# Altium schematic sheet Main schematic.SchDoc
size A4
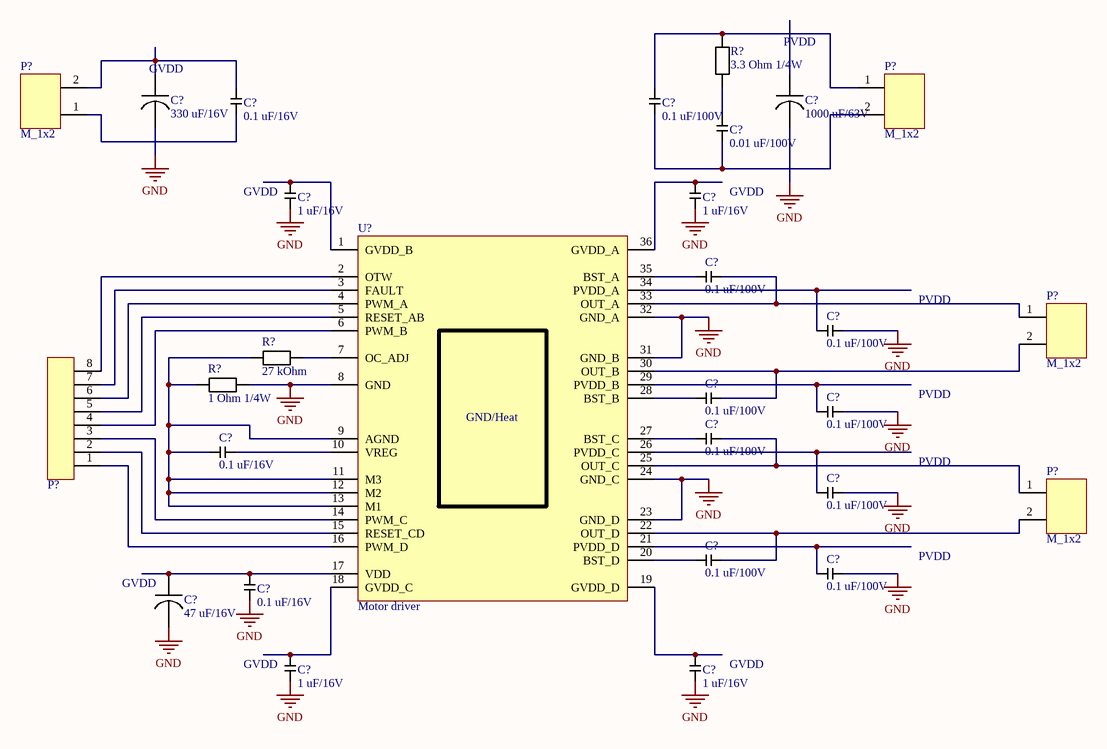
[diagram p0: Main schematic.SchDoc]

## Parts
(Parts that share a designator on the sheet are numbered #1, #2 ... from top to bottom, then left to right.)
*  GVDD
*?#1  PVDD
*?#2  GVDD
*?#3  GVDD
*?#4  PVDD
*?#5  PVDD
*?#6  PVDD
*?#7  PVDD
*?#8  GVDD
*?#9  GVDD
*?#10  GVDD
C?#1  value 330 uF/16V  [C_EL_SMT_Ø10]  (hidden comment: C_EL_SMT_Ø10)
C?#2  value 0.1 uF/16V  [C_SMD_0805_pcb]  (hidden comment: SMD)
C?#3  value 0.1 uF/100V  [C_SMD_0805_pcb]  (hidden comment: SMD)
C?#4  value 1000 uF/63V  [C_EL_SMT_Ø18]  (hidden comment: C_EL_SMT_Ø18)
C?#5  value 0.01 uF/100V  [C_SMD_0805_pcb]  (hidden comment: SMD)
C?#6  value 1 uF/16V  [C_SMD_0805_pcb]  (hidden comment: SMD)
C?#7  value 1 uF/16V  [C_SMD_0805_pcb]  (hidden comment: SMD)
C?#8  value 0.1 uF/100V  [C_SMD_0805_pcb]  (hidden comment: SMD)
C?#9  value 0.1 uF/100V  [C_SMD_0805_pcb]  (hidden comment: SMD)
C?#10  value 0.1 uF/100V  [C_SMD_0805_pcb]  (hidden comment: SMD)
C?#11  value 0.1 uF/100V  [C_SMD_0805_pcb]  (hidden comment: SMD)
C?#12  value 0.1 uF/100V  [C_SMD_0805_pcb]  (hidden comment: SMD)
C?#13  value 0.1 uF/16V  [C_SMD_0805_pcb]  (hidden comment: SMD)
C?#14  value 0.1 uF/100V  [C_SMD_0805_pcb]  (hidden comment: SMD)
C?#15  value 0.1 uF/100V  [C_SMD_0805_pcb]  (hidden comment: SMD)
C?#16  value 0.1 uF/100V  [C_SMD_0805_pcb]  (hidden comment: SMD)
C?#17  value 0.1 uF/16V  [C_SMD_0805_pcb]  (hidden comment: SMD)
C?#18  value 47 uF/16V  [C_EL_SMT_Ø6.3]  (hidden comment: C_EL_SMT_Ø6.3)
C?#19  value 1 uF/16V  [C_SMD_0805_pcb]  (hidden comment: SMD)
C?#20  value 1 uF/16V  [C_SMD_0805_pcb]  (hidden comment: SMD)
P?#1  M_1x2  [PIN_HEADER_M_1x2]
P?#2  M_1x2  [PIN_HEADER_M_1x2]
P?#3  M_1x2  [PIN_HEADER_M_1x2]
P?#4  M_1x10  [PIN_HEADER_M_1X8]  (value not drawn)
P?#5  M_1x2  [PIN_HEADER_M_1x2]
R?#1  value 3.3 Ohm 1/4W  [R_SMD_0805_pcb]  (hidden comment: SMD)
R?#2  value 27 kOhm  [R_SMD_0805_pcb]  (hidden comment: SMD)
R?#3  value 1 Ohm 1/4W  [R_SMD_0805_pcb]  (hidden comment: SMD)
U?  Motor driver  [DRV8432DKDR-SOP36]

## Nets
GND: C?#1.1 C?#4.1 C?#6.1 C?#7.1 C?#9.1 C?#11.1 C?#14.1 C?#16.1 C?#17.2 C?#18.1 C?#19.2 C?#20.2 R?#3.2 U?.8(GND) U?.23(GND_D) U?.24(GND_C) U?.31(GND_B) U?.32(GND_A)
Net*?#1_5: *?#1.5 C?#4.2
Net*?#2_5: *?#2.5 C?#1.2 C?#2.1 P?#1.2
Net*?#3_5: *?#3.5 C?#6.2 U?.1(GVDD_B)
Net*?#4_5: *?#4.5 C?#9.2 U?.34(PVDD_A)
Net*?#5_5: *?#5.5 C?#11.2 U?.29(PVDD_B)
Net*?#6_5: *?#6.5 C?#14.2 U?.26(PVDD_C)
Net*?#7_5: *?#7.5 C?#16.2 U?.21(PVDD_D)
Net*?#8_5: *?#8.5 C?#17.1 C?#18.2 U?.17(VDD)
Net*?#9_5: *?#9.5 C?#19.1 U?.18(GVDD_C)
Net*?#10_5: *?#10.5 C?#20.1 U?.19(GVDD_D)
Net*_5: *.5 C?#7.2 U?.36(GVDD_A)
NetC?#2_2: C?#2.2 P?#1.1
NetC?#3_1: C?#3.1 C?#5.2 P?#2.2
NetC?#3_2: C?#3.2 P?#2.1 R?#1.2
NetC?#5_1: C?#5.1 R?#1.1
NetC?#8_1: C?#8.1 P?#3.1 U?.33(OUT_A)
NetC?#8_2: C?#8.2 U?.35(BST_A)
NetC?#10_1: C?#10.1 P?#3.2 U?.30(OUT_B)
NetC?#10_2: C?#10.2 U?.28(BST_B)
NetC?#12_1: C?#12.1 P?#5.1 U?.25(OUT_C)
NetC?#12_2: C?#12.2 U?.27(BST_C)
NetC?#13_1: C?#13.1 U?.10(VREG)
NetC?#13_2: C?#13.2 R?#2.1 R?#3.1 U?.9(AGND) U?.11(M3) U?.12(M2) U?.13(M1)
NetC?#15_1: C?#15.1 P?#5.2 U?.22(OUT_D)
NetC?#15_2: C?#15.2 U?.20(BST_D)
NetP?#4_1: P?#4.1 U?.16(PWM_D)
NetP?#4_2: P?#4.2 U?.15(RESET_CD)
NetP?#4_3: P?#4.3 U?.14(PWM_C)
NetP?#4_4: P?#4.4 U?.6(PWM_B)
NetP?#4_5: P?#4.5 U?.5(RESET_AB)
NetP?#4_6: P?#4.6 U?.4(PWM_A)
NetP?#4_7: P?#4.7 U?.3(FAULT)
NetP?#4_8: P?#4.8 U?.2(OTW)
NetR?#2_2: R?#2.2 U?.7(OC_ADJ)

## Notes on the sheet
- (in symbol DRV8432DKDR) GND/Heat

## Library data of the parts
* *?#1-*?#10 = Input
C?#2 C?#3 C?#5-C?#17 C?#19 C?#20 = C_SMD_0805: Supplier 1: *; Supplier Part Number 1: *
P?#1-P?#3 P?#5 = PIN_HEADER_M_1x2: Supplier 1: *; Supplier Part Number 1: *
P?#4 = PIN_HEADER_M_1x8: Supplier 1: *; Supplier Part Number 1: *; Category: Pin Header
R?#1-R?#3 = R_SMD_0805: Supplier 1: *; Supplier Part Number 1: *
U? = DRV8432DKDR: IC BRIDGE DRIVER PAR 36HSSOP; Manufacturer 1: Texas Instruments; Max Supply Voltage: 52.5V; Min Supply Voltage: 0uV; Operating Supply Voltage: 50V; Number of Outputs: 2; Output Current: 7A; Nominal Supply Current: 10.5mA; Interface: PWM; Power Dissipation: 5W; Max Output Current: 12A; Fault Protection: Over Temperature,Short Circuit; Supplier 1: Digi-Key; Supplier Part Number 1: 296-29573-1-ND; Manufacturer Part Number 1: DRV8432DKDR; Stock 1: 2413; Pricing 1: 1=11,86000, 10=10,71800, 25=10,21960, 100=8,47480, 250=7,72708 (USD); RoHS: Yes; Mount: Surface Mount; Number of Pins: 36; Min Operating Temperature: -40°C; Max Operating Temperature: 85°C; Packaging: Tape and Reel; Package Quantity: 500; Output Current per Channel: 7A; Radiation Hardening: No; Lead Free: Lead Free; ComponentLink1URL: https://datasheet.ciiva.com/15109/getdatasheetpartid-482142-15109561.pdf?src-supplier=Verical; ComponentLink1Description: https://datasheet.ciiva.com/15109/getdatasheetpartid-482142-15109561.pdf?src-supplier=Verical; ComponentLink2URL: https://datasheet.ciiva.com/1959/drv8432-1959978.pdf?src-supplier=Digi-Key; ComponentLink2Description: https://datasheet.ciiva.com/1959/drv8432-1959978.pdf?src-supplier=Digi-Key; ComponentLink3URL: https://datasheet.ciiva.com/41457/001013555-da-01-en-ic-bridge-driver-drv8432dkdr-ssop-36-tid-41457289.pdf?src-supplier=Conrad; ComponentLink3Description: https://datasheet.ciiva.com/41457/001013555-da-01-en-ic-bridge-driver-drv8432dkdr-ssop-36-tid-41457289.pdf?src-supplier=Conrad; ComponentLink4URL: https://datasheet.ciiva.com/3228/drv8432-3228999.pdf?src-supplier=Avnet; ComponentLink4Description: https://datasheet.ciiva.com/3228/drv8432-3228999.pdf?src-supplier=Avnet; ComponentLink5URL: https://datasheet.ciiva.com/1959/drv8432-1959979.pdf?src-supplier=Digi-Key; ComponentLink5Description: https://datasheet.ciiva.com/1959/drv8432-1959979.pdf?src-supplier=Digi-Key; ComponentLink6URL: https://datasheet.ciiva.com/1959/drv8432-1959980.pdf?src-supplier=Digi-Key; ComponentLink6Description: https://datasheet.ciiva.com/1959/drv8432-1959980.pdf?src-supplier=Digi-Key; Category: Integrated Circuits (ICs)
C?#1 = C_EL_SMT_Ø10: Supplier 1: *; Supplier Part Number 1: *
C?#4 = C_EL_SMT_Ø18: Supplier 1: *; Supplier Part Number 1: *; Category: Capacitors
C?#18 = C_EL_SMT_Ø6.3: Supplier 1: *; Supplier Part Number 1: *